# EAGLE design ESP32-C3 TFT Touch v1.1(3.5'' ili9488) (EAGLE 6.1)
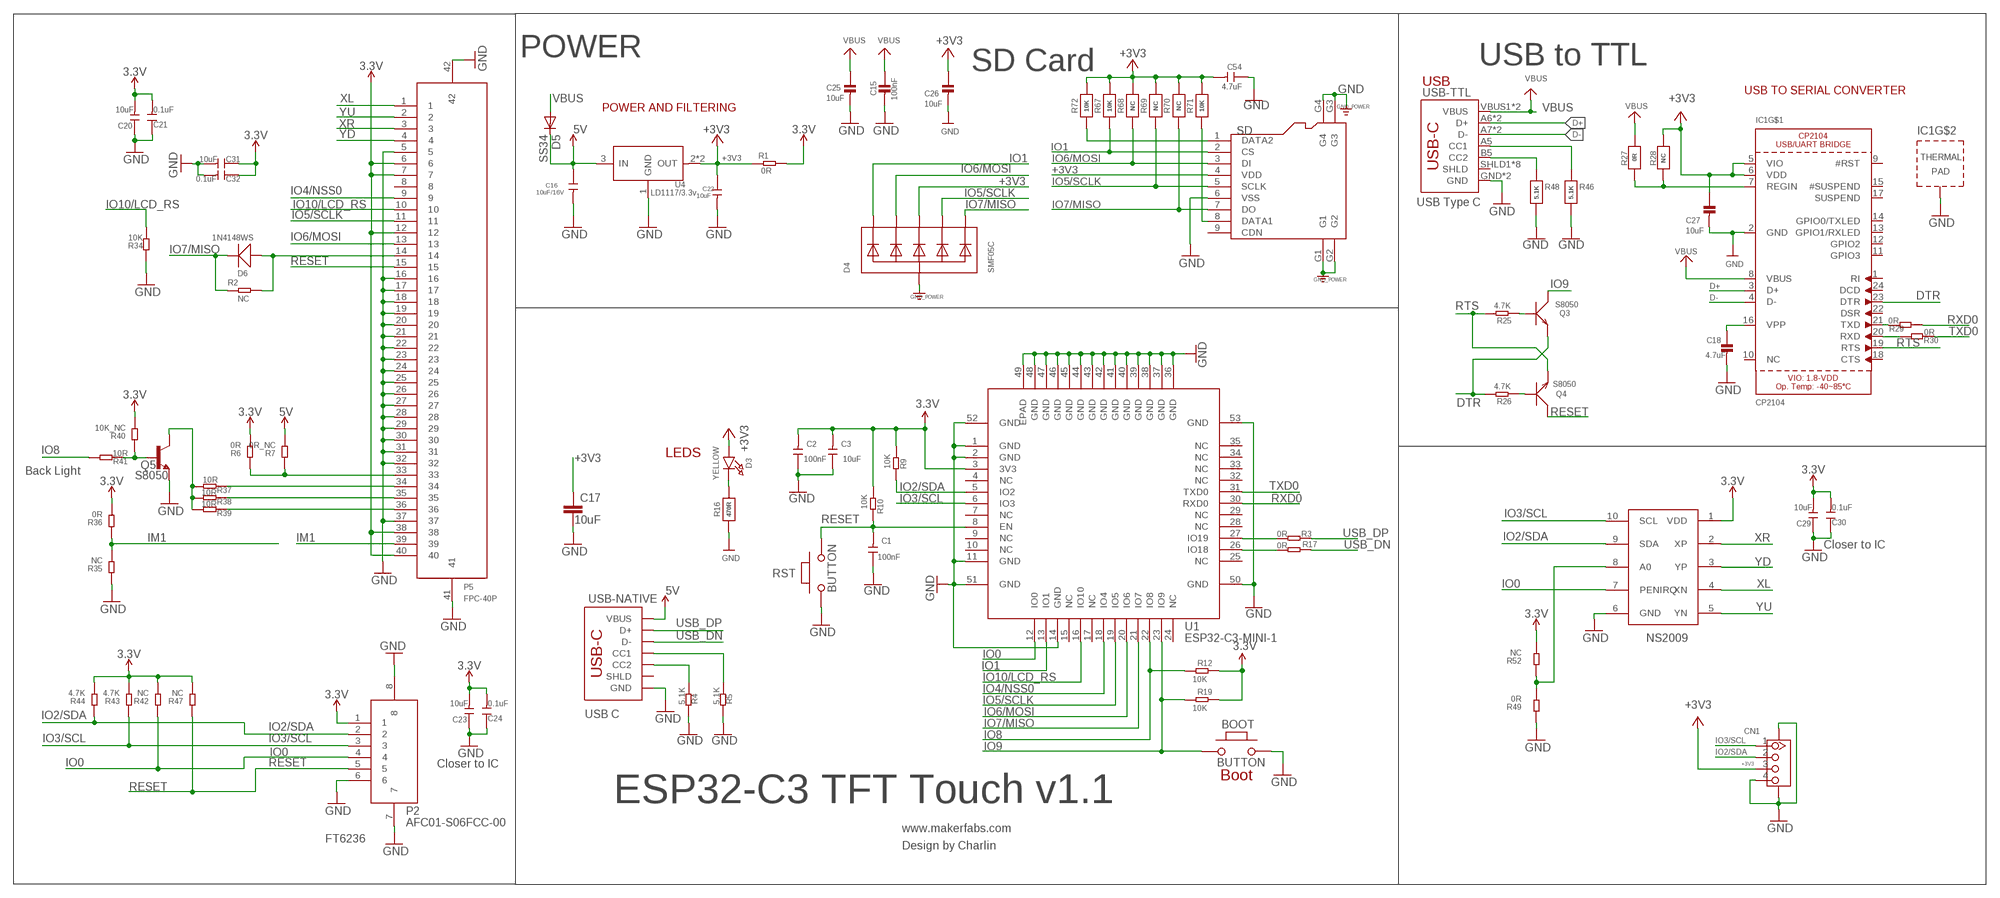
[diagram p0: schematic, sheet 1]

## Parts
BOOT  BUTTON  PB157  [157SW]
C1  100nF  C-0603  [C0603]
C2  100nF  C-0603  [C0603]
C3  10uF  C-0603  [C0603]
C15  100nF  CAP_CERAMIC0603_NO  [0603-NO]
C16  10uF/16V  C-0603  [C0603]
C17  10uF  C-EUC0603  [C0603]
C18  4.7uF  CAP_CERAMIC0603_NO  [0603-NO]
C20  10uF  DISCRETE_C-0603  [DISCRETE_C0603]
C21  0.1uF  DISCRETE_C-0603  [DISCRETE_C0603]
C22  10uF  C-0603  [C0603]
C23  10uF  DISCRETE_C-0603  [DISCRETE_C0603]
C24  0.1uF  DISCRETE_C-0603  [DISCRETE_C0603]
C25  10uF  CAP_CERAMIC0603_NO  [0603-NO]
C26  10uF  CAP_CERAMIC0603_NO  [0603-NO]
C27  10uF  CAP_CERAMIC0603_NO  [0603-NO]
C29  10uF  DISCRETE_C-0603  [DISCRETE_C0603]
C30  0.1uF  DISCRETE_C-0603  [DISCRETE_C0603]
C31  10uF  DISCRETE_C-0603  [DISCRETE_C0603]
C32  0.1uF  DISCRETE_C-0603  [DISCRETE_C0603]
C54  4.7uF  DISCRETE_C-0603  [DISCRETE_C0603]
CN1  GROVE-CONNECTOR-SMD'90D'  [HW4-SMD-2.0-90D]
D3  YELLOW  LED0805_NOOUTLINE  [CHIPLED_0805_NOOUTLINE]
D4  SMF05C  TVSARRAY_5LANE  [SOT363]
D5  SS34  DIODE-DO-214AC  [DO-214AC]
D6  1N4148WS  D'0805'  [SOD323]
IC1  CP2104  [QFN24_4MM_SMSC]
P2  AFC01-S06FCC-00  [SMD8-50P-740L535W]
P5  FPC-40P  [SMD42-50P-2560L490W]
Q3  S8050  TRANSISTOR-NPN-SOT23  [SOT23]
Q4  S8050  TRANSISTOR-NPN-SOT23  [SOT23]
Q5  S8050  SPARKFUN_TRANSISTOR_NPNSOT23  [SPARKFUN_SOT23]
R1  0R  R-0603  [R0603]
R2  NC  R-0603  [R0603]
R3  0R  R-0603  [R0603]
R4  5.1K  R-0603  [R0603]
R5  5.1K  R-0603  [R0603]
R6  0R  DISCRETE_R-0603  [DISCRETE_R0603]
R7  0R_NC  DISCRETE_R-0603  [DISCRETE_R0603]
R9  10K  R-0603  [R0603]
R10  10K  R-0603  [R0603]
R12  10K  R-0603  [R0603]
R16  470R  RESISTOR_0603_NOOUT  [0603-NO]
R17  0R  R-0603  [R0603]
R19  10K  R-0603  [R0603]
R25  4.7K  R-0603  [R0603]
R26  4.7K  R-0603  [R0603]
R27  0R  RESISTOR_0603_NOOUT  [0603-NO]
R28  NC  RESISTOR_0603_NOOUT  [0603-NO]
R29  0R  R-0603  [R0603]
R30  0R  R-0603  [R0603]
R34  10K  DISCRETE_R-0603  [DISCRETE_R0603]
R35  NC  DISCRETE_R-0603  [DISCRETE_R0603]
R36  0R  DISCRETE_R-0603  [DISCRETE_R0603]
R37  10R  DISCRETE_R-0603  [DISCRETE_R0603]
R38  10R  DISCRETE_R-0603  [DISCRETE_R0603]
R39  10R  DISCRETE_R-0603  [DISCRETE_R0603]
R40  10K_NC  DISCRETE_R-0603  [DISCRETE_R0603]
R41  10R  DISCRETE_R-0603  [DISCRETE_R0603]
R42  NC  DISCRETE_R-0603  [DISCRETE_R0603]
R43  4.7K  DISCRETE_R-0603  [DISCRETE_R0603]
R44  4.7K  DISCRETE_R-0603  [DISCRETE_R0603]
R46  5.1K  RESISTOR_0603_NOOUT  [0603-NO]
R47  NC  DISCRETE_R-0603  [DISCRETE_R0603]
R48  5.1K  RESISTOR_0603_NOOUT  [0603-NO]
R49  0R  DISCRETE_R-0603  [DISCRETE_R0603]
R52  NC  DISCRETE_R-0603  [DISCRETE_R0603]
R67  10K  RESISTOR_0603_NOOUT  [0603-NO]
R68  NC  RESISTOR_0603_NOOUT  [0603-NO]
R69  NC  RESISTOR_0603_NOOUT  [0603-NO]
R70  NC  RESISTOR_0603_NOOUT  [0603-NO]
R71  10K  RESISTOR_0603_NOOUT  [0603-NO]
R72  10K  RESISTOR_0603_NOOUT  [0603-NO]
RST  BUTTON  PB157  [157SW]
SD  HOLDER-MICROSD-9P  [9P-SMD-W/-RING]
U1  ESP32-C3-MINI-1  [ESP32-C3-MINI-1]
U4  LD1117/3.3v  LD1117'SOT89'  [SOT89]
U8  NS2009  [MSOP10]
USB-NATIVE  USB C  USB_C_4-LAYER-ISOLATED  [USB-C-16P-4LAYER-ISOLATED]
USB-TTL  USB_C5  [USB-C-16P-5]

## Nets
3.3V: C2.2 C3.2 C20.2 C21.2 C23.2 C24.2 C29.2 C30.2 C31.1 C32.1 P2.1 P5.6 P5.7 P5.12 P5.38 P5.40 R1.2 R6.2 R9.1 R10.1 R12.2 R19.2 R36.2 R40.2 R42.2 R43.2 R44.2 R47.2 R52.2 U1.3(3V3) U8.1(VDD)
5V: C16.1 D5.C R7.2 U4.3(IN) USB-NATIVE.VBUS1(VBUS) USB-NATIVE.VBUS2(VBUS)
+3V3: C17.1 C22.1 C26.1 C27.1 C54.2 CN1.3 D3.A D4.4(C3) IC1.5(VIO) IC1.6(VDD) R1.1 R28.1 R67.2 R68.2 R69.2 R70.2 R71.2 R72.2 SD.4(VDD) U4.2(OUT) U4.4(OUT)
D+: IC1.3(D+) USB-TTL.A6(D+) USB-TTL.B6(D+)
D-: IC1.4(D-) USB-TTL.A7(D-) USB-TTL.B7(D-)
DTR: IC1.23(DTR) Q3.2(E) R26.2
GND: BOOT.2 C1.1 C2.1 C3.1 C15.2 C16.2 C17.2 C18.2 C20.1 C21.1 C22.2 C23.1 C24.1 C25.2 C26.2 C27.2 C29.1 C30.1 C31.2 C32.2 C54.1 CN1.4 CN1.SS1 CN1.SS2 D4.2(A) IC1.2(GND) IC1.THERM(TP) P2.6 P2.7 P2.8 P5.5 P5.16 P5.17 P5.18 P5.19 P5.20 P5.21 P5.22 P5.23 P5.24 P5.25 P5.26 P5.27 P5.28 P5.29 P5.30 P5.31 P5.32 P5.37 P5.41 P5.42 Q5.2(E) R4.1 R5.1 R16.1 R34.1 R35.1 R46.2 R48.2 R49.1 RST.1 SD.6(VSS) SD.G1 SD.G2 SD.G3 SD.G4 U1.1(GND) U1.2(GND) U1.11(GND) U1.14(GND) U1.36(GND) U1.37(GND) U1.38(GND) U1.39(GND) U1.40(GND) U1.41(GND) U1.42(GND) U1.43(GND) U1.44(GND) U1.45(GND) U1.46(GND) U1.47(GND) U1.48(GND) U1.49(EPAD) U1.50(GND) U1.51(GND) U1.52(GND) U1.53(GND) U4.1(GND) U8.6(GND) USB-NATIVE.GND USB-NATIVE.GND2(GND) USB-TTL.GND USB-TTL.GND2(GND) ; supply symbol labelled GND_POWER
IM1: P5.39 R35.2 R36.1
IO0: P2.4 R42.1 U1.12(IO0) U8.7(PENIRQ)
IO1: D4.1(C1) R67.1 SD.2(CS) U1.13(IO1)
IO2/SDA: CN1.2 P2.2 R9.2 R44.1 U1.5(IO2) U8.9(SDA)
IO3/SCL: CN1.1 P2.3 R43.1 U1.6(IO3) U8.10(SCL)
IO4/NSS0: P5.9 U1.18(IO4)
IO5/SCLK: D4.5(C4) P5.11 R69.1 SD.5(SCLK) U1.19(IO5)
IO6/MOSI: D4.3(C2) P5.13 R68.1 SD.3(DI) U1.20(IO6)
IO7/MISO: D4.6(C5) D6.- R2.1 R70.1 SD.7(DO) U1.21(IO7)
IO8: R12.1 R41.2 U1.22(IO8)
IO9: BOOT.1 Q3.3(C) R19.1 U1.23(IO9)
IO10/LCD_RS: P5.10 R34.2 U1.16(IO10)
N$1: C18.1 IC1.16(VPP)
N$2: Q4.1(B) R26.1
N$3: Q3.1(B) R25.1
N$4: D6.+ P5.14 R2.2
N$7: D3.C R16.2
N$10: R46.1 USB-TTL.A5(CC1)
N$11: R48.1 USB-TTL.B5(CC2)
N$12: IC1.7(REGIN) R27.2 R28.2
N$13: R3.1 U1.27(IO19)
N$14: R5.2 USB-NATIVE.A5(CC1)
N$15: R4.2 USB-NATIVE.B5(CC2)
N$16: R17.1 U1.26(IO18)
N$18: IC1.21(TXD) R29.2
N$19: IC1.20(RXD) R30.2
N$20: P5.34 R37.1
N$21: P5.35 R38.1
N$22: P5.36 R39.1
N$23: Q5.1(B) R40.1 R41.1
N$24: Q5.3(C) R37.2 R38.2 R39.2
N$25: R49.2 R52.1 U8.8(A0)
N$26: P5.33 R6.1 R7.1
N$47: R72.1 SD.1(DATA2)
N$48: R71.1 SD.8(DATA1)
RESET: C1.2 P2.5 P5.15 Q4.3(C) R10.2 R47.1 RST.2 U1.8(EN)
RTS: IC1.19(RTS) Q4.2(E) R25.2
RXD0: R29.1 U1.30(RXD0)
TXD0: R30.1 U1.31(TXD0)
USB_DN: R17.2 USB-NATIVE.A7(D-) USB-NATIVE.B7(D-)
USB_DP: R3.2 USB-NATIVE.A6(D+) USB-NATIVE.B6(D+)
VBUS: C15.1 C25.1 D5.A IC1.8(VBUS) R27.1 USB-TTL.VBUS1(VBUS) USB-TTL.VBUS2(VBUS)
XL: P5.1 U8.4(XN)
XR: P5.3 U8.2(XP)
YD: P5.4 U8.3(YP)
YU: P5.2 U8.5(YN)
Unconnected: IC1.1(RI) IC1.9(#RST) IC1.10(NC) IC1.11(GPIO3) IC1.12(GPIO2) IC1.13(GPIO1/RXLED) IC1.14(GPIO0/TXLED) IC1.15(#SUSPEND) IC1.17(SUSPEND) IC1.18(CTS) IC1.22(DSR) IC1.24(DCD) P5.8 SD.9(CDN) U1.4(NC) U1.7(NC) U1.9(NC) U1.10(NC) U1.15(NC) U1.17(NC) U1.24(NC) U1.25(NC) U1.28(NC) U1.29(NC) U1.32(NC) U1.33(NC) U1.34(NC) U1.35(NC) USB-NATIVE.SHLD1(SHLD) USB-NATIVE.SHLD2(SHLD) USB-NATIVE.SHLD3(SHLD) USB-NATIVE.SHLD4(SHLD) USB-NATIVE.SHLD5(SHLD) USB-NATIVE.SHLD6(SHLD) USB-NATIVE.SHLD7(SHLD) USB-NATIVE.SHLD8(SHLD) USB-TTL.SHLD1(SHLD) USB-TTL.SHLD2(SHLD) USB-TTL.SHLD3(SHLD) USB-TTL.SHLD4(SHLD) USB-TTL.SHLD5(SHLD) USB-TTL.SHLD6(SHLD) USB-TTL.SHLD7(SHLD) USB-TTL.SHLD8(SHLD)

## Notes on the sheet
- POWER | USB to TTL
- SD Card
- USB
- USB TO SERIAL CONVERTER
- POWER AND FILTERING
- USB Type C
- LEDS
- Back Light
- Closer to IC
- NS2009
- Closer to IC
- Boot
- ESP32-C3 TFT Touch v1.1
- www.makerfabs.com
- FT6236
- Design by Charlin

## Library data of the parts
BOOT RST = MySMD:PB157
C1-C3 C16 C22 = Discrete:C*: Ceramic Capacitors
C15 C18 C25-C27 = microbuilder:CAP_CERAMIC: Ceramic Capacitors For new designs, use the packages preceded by an '_' character since they are more reliable: The following footprints should be used on most boards: _0402 - Standard footprint for regular board layouts _0603 - Standard footprint for regular board layouts _0805 - Standard footprint for regular board layouts _1206 - Standard footprint for regular board layouts For extremely tight-pitch boards where space is at a premium, the following 'micro-pitch' footprints can be used (smaller pads, no silkscreen outline, etc.): _0402MP - Micro-pitch footprint for very dense/compact boards _0603MP - Micro-pitch footprint for very dense/compact boards _0805MP - Micro-pitch footprint for very dense/compact boards _1206MP - Micro-pitch footprint for very dense/compact boards
C17 = rcl:C-EU: CAPACITOR, European symbol
C20 C21 C23 C24 C29-C32 C54 = A9G:DISCRETE_C*: Ceramic Capacitors
CN1 = Connector-new:GROVE-CONNECTOR-SMD: 4P-SMD-2.0:320110030;4P-SMD-2.0-90D:320110032
D3 = microbuilder:LED: LED 0603 - 0603 Surface Mount Package 2mA: Green LED - Low Power (3.9mcd, 2ma, 1.7Vf) - Digikey: 475-2709-2-ND Orange LED - Low Power (9.8mcd, 2ma, 1.8Vf) - Digikey: 475-1194-2-ND Red LED - Low Power (5mcd, 2ma, 1.8Vf) - Digikey: 475-1195-2-ND Yellow LED - Low Power (7mcd, 2ma, 1.8Vf) - Digikey: 475-1196-2-ND 5mA: Blue LED - Low Power (17mcd, 5ma, 2.9Vf) - Digikey: LNJ937W8CRACT-ND 0805 - 0805 Surface Mount Package 2mA: Red LED (8.8mcd, 2mA, 1.8Vf, Clear) - Low Power [Digikey: 475-2510-1-ND] Green LED (5mcd, 2mA, 1.8Vf, Clear) - Low Power [Digikey: 475-2730-1-ND] Yellow LED (11.3mcd, 2mA, 1.8Vf, Clear) - Low Power [Digikey: 475-2555-1-ND] 20mA: Red LED (104mcd, 20mA, Diffused) - LS R976 [Digikey: 475-1278-6-ND] Red LED (12mcd, 20mA, 2.0Vf, Clear) - APT2012EC [Digikey: 754-1128-1-ND] Green LED (15mcd, 20mA, 2.2Vf, Clear) - APT2012GC [Digikey: 754-1131-1-ND] Orange LED (160mcd, 20mA, 2.1Vf, Clear) - APT2012SECK [Digikey: 754-1130-1-ND] 1206 - 1206 Surface Mount Package Green LED (26mcd, 20mA, Diffused) - LG N971 [Digikey: 475-1407-6-ND] Red LED (15mcd, 20mA, Diffused) - LH N974 [Digikey: 475-1416-6-ND] Cree - Cree High-Power Surface Mount LEDs XPEBWT-L1-0000-00D50 - White 111lm 350mA 2.9Vf 6200K 110° XTEAWT-00-0000-00000LEE3 - White 114lm 350mA 2.85Vf 5000K 115° Everlight - Everlight 45-21 Series Surface Mount LEDs 45-21/QK2C-B2832AC2CB2/2T - Warm White 2000mcd 20mA 3.25Vf 3050K 120° 45-21/LK2C-B38452C4CB2/2T - Nuetral White 2000mcd 20mA 3.25Vf 4150K 120° 45-21/LK2C-B50634C6CB2/2T - Cold White 2200mcd 20mA 3.25Vf 5650K 120° PLCC2 Reverse Mount LS T77K-J1L2-1-0-2-R18-Z - Red 11.25mcd 2mA 1.8Vf 630nm 120° LO T77K-L1M2-24-Z - Orange 19.6mcd 2mA 1.8Vf 606nm 120° LY T77K-K2M1-26-Z - Yellow 15.7mcd 2mA 1.8Vf 587nm 120°
D4 = microbuilder:TVSARRAY_5LANE: Voltage Transient Suppressor Array SOT363 SMF05C - 100W 5V: Digikey - SMF05CT1GOSCT-ND
D5 = diode:DIODE-: DIODE
D6 = Discrete:D*
IC1 = microbuilder:CP2104: CP2104 - USB to UART Bridge VDD Output: 3.45V
P2 = self:AFC01-S06FCC-00
P5 = self:FPC-40P
Q3 Q4 = Discrete:TRANSISTOR-NPN*: NPN audion
Q5 = Adafruit_HUZZAH32_ESP32_Feather:SPARKFUN_TRANSISTOR_NPN: Transistor NPN BJT configuration in SOT23 package. MMBT2222 is the common NPN we use. Double check BCE configuration again layout.
R1-R5 R9 R10 R12 R17 R19 R25 R26 R29 R30 = Discrete:R*
R6 R7 R34-R44 R47 R49 R52 = A9G:DISCRETE_R*
R16 R27 R28 R46 R48 R67-R72 = microbuilder:RESISTOR: Resistors For new designs, use the packages preceded by an '_' character since they are more reliable: The following footprints should be used on most boards: _0402 - Standard footprint for regular board layouts _0603 - Standard footprint for regular board layouts _0805 - Standard footprint for regular board layouts _1206 - Standard footprint for regular board layouts For extremely tight-pitch boards where space is at a premium, the following 'micro-pitch' footprints can be used (smaller pads, no silkscreen outline, etc.): _0402MP - Micro-pitch footprint for very dense/compact boards _0603MP - Micro-pitch footprint for very dense/compact boards _0805MP - Micro-pitch footprint for very dense/compact boards _1206MP - Micro-pitch footprint for very dense/compact boards
SD = Connector:HOLDER-MICROSD-9P
U1 = self:ESP32-C3-MINI-1
U4 = IC:LD1117: Low Drop Fixed And Adjustable Positive Voltage Regulators http://www.datasheetcatalog.org/datasheet/SGSThomsonMicroelectronics/mXuqtqv.pdf
U8 = NS2009:NS2009
USB-NATIVE = SparkFun-Connectors:USB_C: USB Type C 16Pin Connector Super Speed pins not available on the 16-pin purely SMD connector so this part is best for USB 2.0 implementations. D1 and D2 are tied together enabling D+/- no matter which way the cable is plugged into the connector. The two channel configuration pins (CC1/2) are ...; PROD_ID: CONN-14122; VALUE: USB Female Type C Connector
USB-TTL = USBC:USB_C: USB Type C 16Pin Connector Super Speed pins not available on the 16-pin purely SMD connector so this part is best for USB 2.0 implementations. D1 and D2 are tied together enabling D+/- no matter which way the cable is plugged into the connector. The two channel configuration pins (CC1/2) are ...

## Net classes
1 vbat: width 0.254 mm, drill 0.305 mm, clearance 0.152 mm

## Board
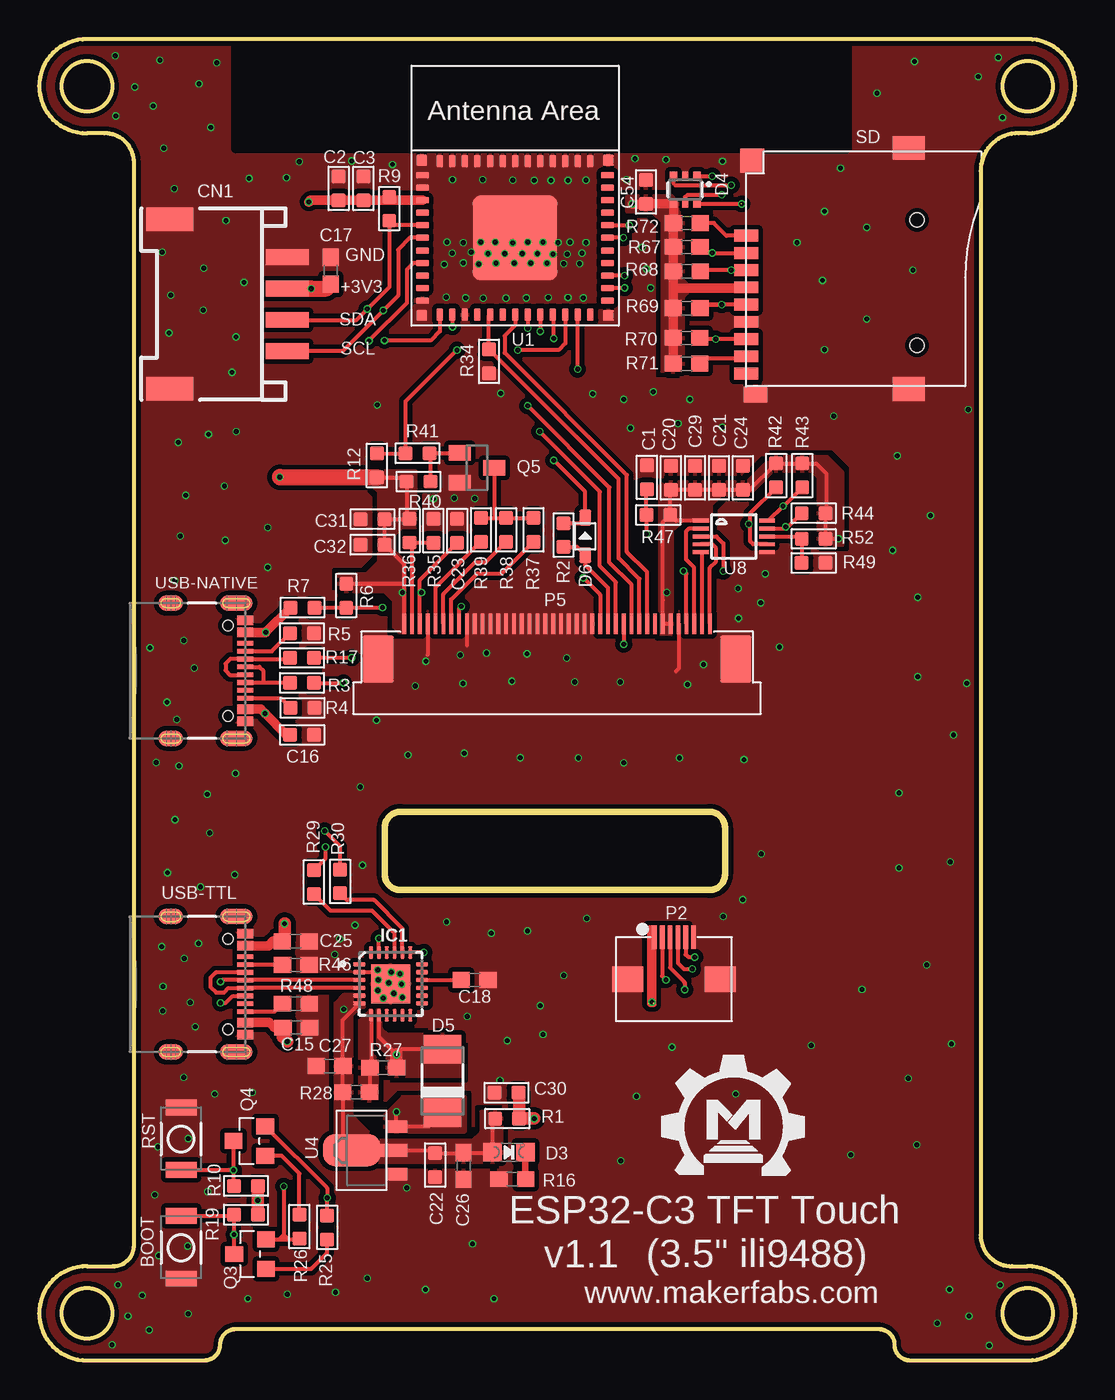
[diagram p1: board, top side]
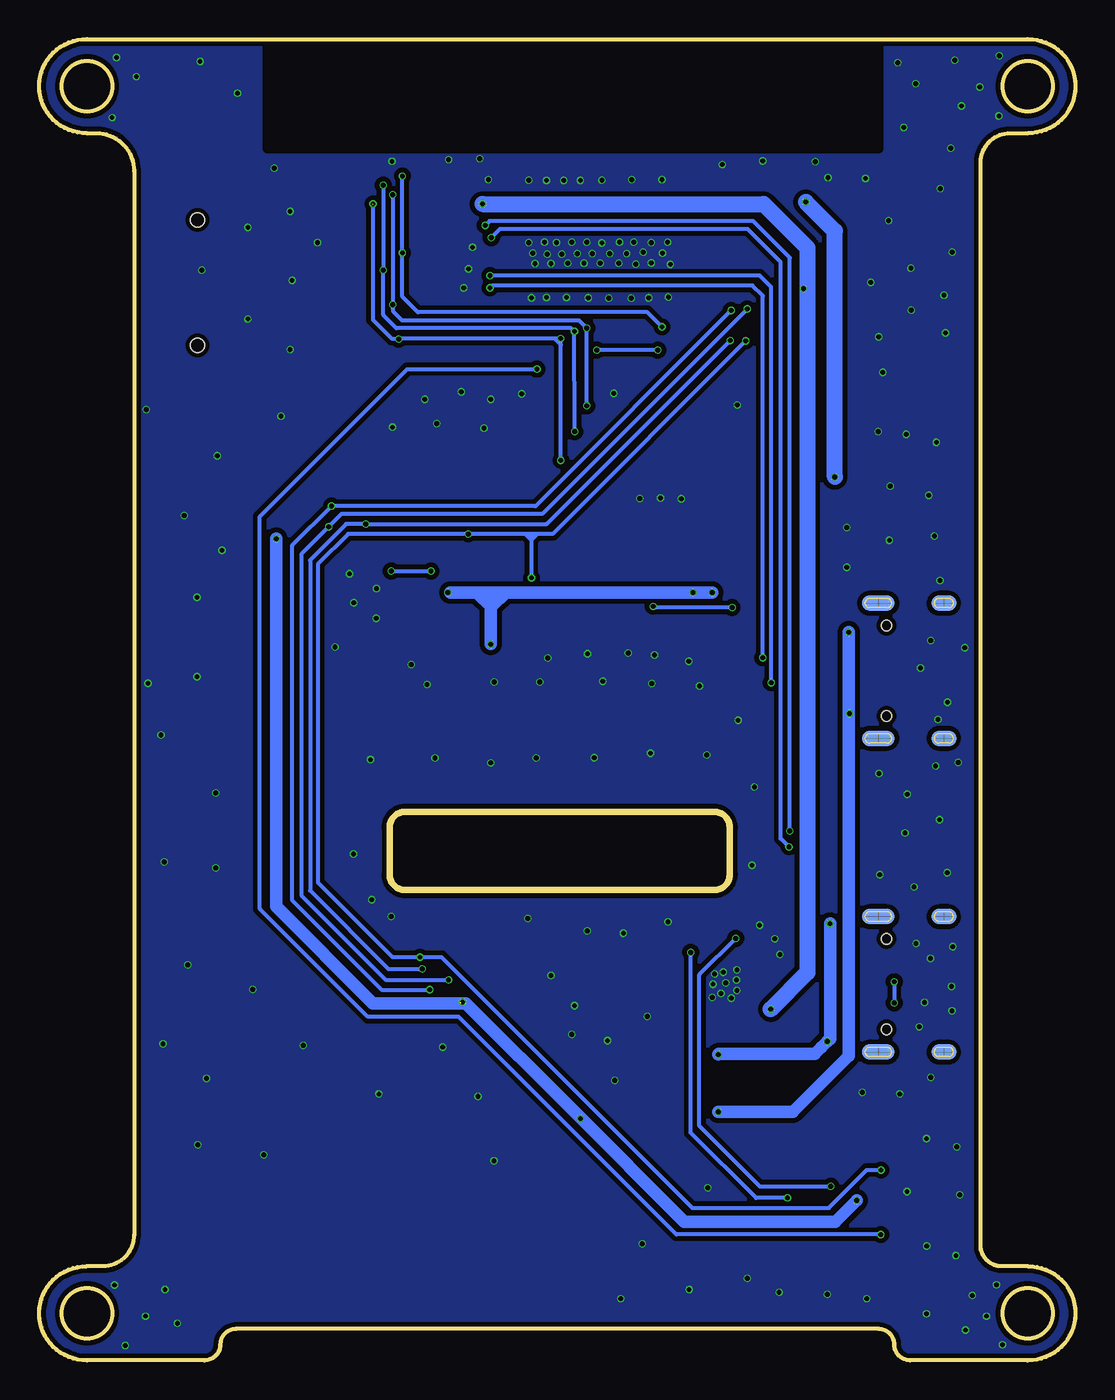
[diagram p2: board, bottom side, seen from below]

Size 66.1 x 84.3 mm. Coordinates in mm from the lower left corner, seen from the top.
Outline: 55.55,0 63.05,0 arc182 63.05,6 62.05,6 arc-90 60.05,8 60.05,75.9 arc-90 62.45,78.3 63.05,78.3 arc182 63.05,84.3 3.05,84.3 arc182 3.05,78.3 4.17,78.3 arc-90 6.05,76.42 6.05,7.34 arc-90 4.7,6 3.05,6 arc182 3.05,0 10.55,0 arc90 11.55,1 arc-90 12.55,2 53.55,2 arc-90 54.55,1 arc90 55.55,0
Outline: 23.05,35 42.75,35 arc-90 43.75,34 43.75,31 arc-90 42.75,30 23.05,30 arc-90 22.05,31 22.05,34 arc-90 23.05,35
Outline: circle at 3.05,81.3 radius 1.6
Outline: circle at 3.05,3 radius 1.6
Outline: circle at 63.05,3 radius 1.6
Outline: circle at 63.05,81.3 radius 1.6
Copper layers (1*16): Top 0.035mm / dielectric 1.5mm / Bottom 0.035mm
Design rules: minimum track width 6mil, minimum drill 10mil, track to track 6mil, track to pad 6mil, pad to pad 6mil, via to via 6mil, smd to smd 0mil, copper to edge 10mil, drill to drill 10mil, minimum pad ring 3mil, minimum via ring 3mil, stop-mask expansion 2mil, vias tented up to drill 100mil, thermal gap 0mil
tRestrict: area 12.5,77.3 to 51.5,85
bRestrict: area 12.5,77.3 to 51.5,85

### Footprints (pad centres in the part's own frame; a part is rotated, then mirrored left to right if it is on the bottom)
157SW = smd 1.016 x 1.981: 1 0,0; 2 4,0
C0603 = smd 0.889 x 0.889: 1 -0.762,0; 2 0.762,0
0603-NO = smd 1.1 x 1: 1 -0.85,0; 2 0.85,0
C0603' = smd 1.1 x 1: 1 -0.85,0; 2 0.85,0
DISCRETE_C0603 = smd 0.889 x 0.889: 1 -0.762,0; 2 0.762,0
HW4-SMD-2.0-90D = smd 1.01 x 2.74: 1 -3,-0.1; 2 -1,-0.1; 3 1,-0.1; 4 3,-0.1 | smd 1.5 x 3: SS1 -5.4,7.4; SS2 5.4,7.4
CHIPLED_0805_NOOUTLINE = smd 1.2 x 1.2: A 0,-1.05; C 0,1.05
SOT363 = smd 0.5 x 0.5: 1 -0.75,-0.9; 3 0.75,-0.9; 4 0.75,0.9; 6 -0.75,0.9 | smd 0.4 x 0.5: 2 0,-0.9; 5 0,0.9
DO-214AC = smd 1.8 x 2.4: A 2.025,0; C -2.025,0
SOD323 = smd 1 x 0.8: + -1.2,0; - 1.2,0
QFN24_4MM_SMSC = smd 0.8 x 0.28: 1 -2,1.25; 2 -2,0.75; 3 -2,0.25; 4 -2,-0.25; 5 -2,-0.75; 6 -2,-1.25; 13 2,-1.25; 14 2,-0.75; 15 2,-0.25; 16 2,0.25; 17 2,0.75; 18 2,1.25 | smd 0.28 x 0.8: 7 -1.25,-2; 8 -0.75,-2; 9 -0.25,-2; 10 0.25,-2; 11 0.75,-2; 12 1.25,-2; 19 1.25,2; 20 0.75,2; 21 0.25,2; 22 -0.25,2; 23 -0.75,2; 24 -1.25,2 | smd 2.5 x 2.5: THERM 0,0
SMD8-50P-740L535W = smd 0.3 x 1.5: 1 -1.25,0; 2 -0.75,0; 3 -0.25,0; 4 0.25,0; 5 0.75,0; 6 1.25,0 | smd 2 x 1.6: 7 2.95,-2.68; 8 -2.95,-2.68
SMD42-50P-2560L490W = smd 0.3 x 1.3: 1 9.75,0; 2 9.25,0; 3 8.75,0; 4 8.25,0; 5 7.75,0; 6 7.25,0; 7 6.75,0; 8 6.25,0; 9 5.75,0; 10 5.25,0; 11 4.75,0; 12 4.25,0; 13 3.75,0; 14 3.25,0; 15 2.75,0; 16 2.25,0; 17 1.75,0; 18 1.25,0; 19 0.75,0; 20 0.25,0; 21 -0.25,0; 22 -0.75,0; 23 -1.25,0; 24 -1.75,0; 25 -2.25,0; 26 -2.75,0; 27 -3.25,0; 28 -3.75,0; 29 -4.25,0; 30 -4.75,0; 31 -5.25,0; 32 -5.75,0; 33 -6.25,0; 34 -6.75,0; 35 -7.25,0; 36 -7.75,0; 37 -8.25,0; 38 -8.75,0; 39 -9.25,0; 40 -9.75,0 | smd 2 x 3: 41 -11.4,-2.25; 42 11.4,-2.25
SOT23 = smd 1.016 x 1.143: 1 -0.95,-1.016; 2 0.95,-1.016; 3 0,1.016
SPARKFUN_SOT23 = smd 1 x 1.4: 1 -0.95,-1.1; 2 0.95,-1.1; 3 0,1.1
R0603 = smd 0.889 x 0.889: 1 -0.762,0; 2 0.762,0
DISCRETE_R0603 = smd 0.889 x 0.889: 1 -0.762,0; 2 0.762,0
9P-SMD-W/-RING = smd 1.524 x 0.762: 1 0,4.4; 2 0,3.3; 3 0,2.2; 4 0,1.1; 5 0,0; 6 0,-1.1; 7 0,-2.2; 8 0,-3.3; 9 0,-4.4 | smd 1.524 x 1.016: G1 0.6,-5.746 | smd 2.032 x 1.524: G2 10.373,-5.4; G3 10.373,10 | smd 1.524 x 1.524: G4 0.392,9.181 | hole 0.889: 10.9,-2.6; 10.9,5.4
ESP32-C3-MINI-1 = smd 0.8 x 0.4: 1 -5.9,1.3; 2 -5.9,0.5; 3 -5.9,-0.3; 4 -5.9,-1.1; 5 -5.9,-1.9; 6 -5.9,-2.7; 7 -5.9,-3.5; 8 -5.9,-4.3; 9 -5.9,-5.1; 10 -5.9,-5.9; 11 -5.9,-6.7; 25 5.9,-6.7; 26 5.9,-5.9; 27 5.9,-5.1; 28 5.9,-4.3; 29 5.9,-3.5; 30 5.9,-2.7; 31 5.9,-1.9; 32 5.9,-1.1; 33 5.9,-0.3; 34 5.9,0.5; 35 5.9,1.3 | smd 0.4 x 0.8: 12 -4.8,-7.6; 13 -4,-7.6; 14 -3.2,-7.6; 15 -2.4,-7.6; 16 -1.6,-7.6; 17 -0.8,-7.6; 18 0,-7.6; 19 0.8,-7.6; 20 1.6,-7.6; 21 2.4,-7.6; 22 3.2,-7.6; 23 4,-7.6; 24 4.8,-7.6; 36 4.8,2.2; 37 4,2.2; 38 3.2,2.2; 39 2.4,2.2; 40 1.6,2.2; 41 0.8,2.2; 42 0,2.2; 43 -0.8,2.2; 44 -1.6,2.2; 45 -2.4,2.2; 46 -3.2,2.2; 47 -4,2.2; 48 -4.8,2.2 | smd 5.4 x 5.4: 49 0,-2.7 | smd 0.7 x 0.7: 50 -5.95,2.25; 51 -5.95,-7.65; 52 5.95,2.25; 53 5.95,-7.65
SOT89 = smd 0.8 x 1.4: 1 -1.524,-1.905; 3 1.524,-1.905 | smd 0.8 x 1.9: 2 0,-1.651 | smd 2.032 x 3.65: 4 0,0.94
MSOP10 = smd 0.25 x 1: 1 -1,-2.113; 2 -0.5,-2.113; 3 0,-2.113; 4 0.5,-2.113; 5 1,-2.113; 6 1,2.113; 7 0.5,2.113; 8 0,2.113; 9 -0.5,2.113; 10 -1,2.113
USB-C-16P-4LAYER-ISOLATED = smd 0.3 x 1: A5 -1.25,-0.34; A6 -0.25,-0.34; A7 0.25,-0.34; A8 1.25,-0.34; B5 1.75,-0.34; B6 0.75,-0.34; B7 -0.75,-0.34; B8 -1.75,-0.34 | smd 0.6 x 1: GND -3.225,-0.34; GND2 3.225,-0.34; VBUS1 -2.45,-0.34; VBUS2 2.45,-0.34 | smd 1 x 2.1: SHLD1 -4.32,-0.915; SHLD2 4.32,-0.915 | smd 1 x 2.1 bottom: SHLD3 -4.32,-0.915; SHLD4 4.32,-0.915 | smd 1 x 1.6: SHLD5 -4.32,-5.095; SHLD8 4.32,-5.095 | smd 1 x 1.6 bottom: SHLD6 -4.32,-5.095; SHLD7 4.32,-5.095 | hole 0.65: -2.89,-1.445; 2.89,-1.445
USB-C-16P-5 = smd 0.3 x 1: A5 -1.25,-0.34; A6 -0.25,-0.34; A7 0.25,-0.34; A8 1.25,-0.34; B5 1.75,-0.34; B6 0.75,-0.34; B7 -0.75,-0.34; B8 -1.75,-0.34 | smd 0.6 x 1: GND -3.225,-0.34; GND2 3.225,-0.34; VBUS1 -2.45,-0.34; VBUS2 2.45,-0.34 | smd 1 x 2.1: SHLD1 -4.32,-0.915; SHLD2 4.32,-0.915 | smd 1 x 2.1 bottom: SHLD3 -4.32,-0.915; SHLD4 4.32,-0.915 | smd 1 x 1.6: SHLD5 -4.32,-5.095; SHLD8 4.32,-5.095 | smd 1 x 1.6 bottom: SHLD6 -4.32,-5.095; SHLD7 4.32,-5.095 | hole 0.65: -2.89,-1.445; 2.89,-1.445

### Placement (x,y rotation side)
BOOT  9.05,9.22 270 top
C1  38.76,56.34 270 top
C2  19.1,74.78 270 top
C3  20.68,74.78 270 top
C15  16.4,21.24 0 top
C16  16.77,39.91 0 top
C17  10uF  [C0603']  18.6,69.53 90 top
C18  27.77,24.27 0 top
C20  40.29,56.31 270 top
C21  43.36,56.31 270 top
C22  25.26,12.46 270 top
C23  26.66,52.94 270 top
C24  44.88,56.31 270 top
C25  16.36,26.73 0 top
C26  27.07,12.4 270 top
C27  18.53,18.79 180 top
C29  41.83,56.31 270 top
C30  29.81,17.07 0 top
C31  21.26,53.68 180 top
C32  21.26,52.04 180 top
C54  38.71,74.55 270 top
CN1  15.73,67.39 90 top
D3  29.96,13.28 270 top
D4  41.21,74.7 180 top
D5  25.73,17.83 90 top
D6  34.83,52.57 90 top
IC1  22.42,24.02 0 top
P2  40.49,27 0 top
P5  33.03,47 0 top
Q3  13.45,6.78 90 top
Q4  13.41,13.99 90 top
Q5  27.93,56.95 270 top
R1  29.85,15.42 0 top
R2  33.44,52.66 270 top
R3  16.77,43.23 180 top
R4  16.79,41.63 180 top
R5  16.77,46.41 180 top
R6  19.59,48.79 90 top
R7  16.79,48.03 180 top
R9  22.33,73.48 270 top
R10  13.19,11.13 180 top
R12  21.54,57.1 270 top
R16  30.18,11.56 0 top
R17  16.77,44.83 180 top
R19  13.19,9.3 0 top
R25  18.37,8.48 90 top
R26  16.6,8.53 270 top
R27  21.94,18.68 180 top
R28  20.22,17.11 0 top
R29  17.51,30.52 270 top
R30  19.19,30.56 270 top
R34  28.69,63.75 90 top
R35  25.14,52.94 270 top
R36  23.62,52.94 90 top
R37  31.53,52.99 90 top
R38  29.79,52.99 90 top
R39  28.18,52.99 90 top
R40  24.2,56.07 180 top
R41  24.13,57.89 180 top
R42  47.01,56.46 90 top
R43  48.67,56.46 90 top
R44  49.4,54.05 0 top
R46  16.36,25.23 0 top
R47  39.49,53.94 0 top
R48  16.37,22.76 0 top
R49  49.4,50.88 180 top
R52  49.4,52.42 0 top
R67  41.31,71.04 180 top
R68  41.31,69.49 180 top
R69  41.3,67.14 180 top
R70  41.29,65.23 180 top
R71  41.29,63.59 180 top
R72  41.31,72.56 180 top
RST  9.05,16.15 270 top
SD  45.09,67.36 0 top
U1  30.36,74.32 0 top
U4  20.87,13.4 90 top
U8  44.31,52.57 270 top
U$1  [MAKERFABS_0.3]  40.17,11.84 0 top
USB-NATIVE  13.49,44 270 top
USB-TTL  13.49,24 270 top

### Tracks (layer width: path | path; a pad name or v marks a point on that pad's centre or on a via)
3.3V  (via drill 0.3)  (2 unrouted)
  Top 0.254: 23.28,49.48 P5.40 23.28,48.88 v23.17,49 | 23.28,49.48 23.28,50.78 C32.1 C31.1 23.6,53.68 R36.2 23.44,53.89 R40.2 23.17,56.34 R12.2 | P5.7 P5.6 | 24.28,48.94 24.28,49.8 C23.2 | P5.7 39.78,53.47 R47.2 | R47.2 40.25,55.52 C20.2 C29.2 C21.2 C24.2 45.34,55.55 R42.2 R43.2 49.56,57.22 50.19,56.59 50.19,54.08 R44.2 R52.2 v50.98,52.42 v50.98,52.43 | U8.1 40.63,53.57 R47.2 | P2.1 39.24,22.85 | 39.25,27.61 38.89,27.61 38.89,22.73 38.94,22.68 39.25,22.68 39.25,27.61 | 39.25,27.61 39.09,27.46 39.09,22.68 | R9.1 22.33,74.07 22.38,74.02 | 20.76,74.02 20.75,74.02 C3.2 C2.2 | R6.2 23.21,49.55 23.28,49.48 | P5.7 39.78,48.49 | P5.12 37.28,45.7 v37.29,45.7 | P5.38 24.28,48.89 | 24.28,48.89 v24.39,49 | 24.28,48.89 24.28,48.94 | 24.28,48.94 24.34,49
  Top 0.61: U1.3 22.38,74.02 20.76,74.02 17.31,74.02 v17.2,73.91
  Top 0.813: v31.58,15.43 R1.2 30.62,17.07 C30.2 | R19.2 v13.95,10.21 R10.1
  Top 1.016: R12.2 15.37,56.34 v15.34,56.36
  Bottom 0.254: v31.58,15.43 31.58,15.47 32.05,15.94 | 38.89,22.78 39.17,22.78 v39.09,22.86 | 39.88,49 v40.03,49
  Bottom 0.813: v13.95,10.21 15.32,8.84 24.95,8.84 32.05,15.94 38.89,22.78 44.81,22.78 50.98,28.96 v50.98,52.43 | 39.88,49 38.15,49 | 38.15,49 37.04,49 | 37.04,49 36.35,49 | v37.29,45.7 37.29,48.74 37.04,49 | 36.35,49 37.27,48.08 38.15,48.97 38.15,49 | v23.17,49 v24.39,49 36.35,49
  Bottom 1.016: v15.34,56.36 15.34,72.06 v17.2,73.91
  pour Top: 19.08,49.07 22.02,49.07 22.61,48.49 22.61,46.81 22.94,46.48 23.32,46.48 23.32,50.95 22.69,51.59 22.69,52.73 23.12,53.16 24.01,53.16 24.01,56.67 24.01,56.72 20.78,56.72 20.78,55.96 21.14,55.96 21.64,55.45 21.64,50.93 20.86,50.14 19.08,50.14
  pour Top: 39.63,46.33 39.63,55.78 39.88,56.03 45.16,56.03 46.79,57.66 50.24,57.66 51.21,56.69 51.21,52.02 49.74,52.02 49.74,56.31 49.3,56.74 46.76,56.74 45.21,55.19 43.46,55.19 42.83,54.56 42.83,53.54 40.97,53.54 40.57,53.14 40.36,52.93 40.36,46.35 40.34,46.33
5V  (via drill 0.3)
  Top 0.254: D5.C 24.85,14.92 U4.3 22.78,15.84 v22.79,15.85
  Top 0.61: USB-NATIVE.VBUS1 v14.45,46.45 v14.46,46.46 R7.2 | USB-NATIVE.VBUS2 14.13,41.55 v14.41,41.27 15.77,39.91 C16.1
  Bottom 0.254: v14.41,41.27 14.41,41.05 14.46,41
  Bottom 0.813: v22.79,15.85 18.04,15.85 14.46,19.43 14.46,41 v14.46,46.46
  pour Top: 27.13,14.58 22.08,14.58 22.08,15.67 23.22,16.81 27.08,16.81 27.13,16.81
+3V3  (via drill 0.3)
  Top 0.254: IC1.5 IC1.6 19.38,21.73 C27.1 19.37,18.77 R28.1 19.37,13.96 U4.4 U4.2 25.08,13.4 C22.1 27.03,13.22 C26.1 28.89,13.25 D3.A 28.92,15.25 R1.1
  Top 0.61: v37.82,73.79 C54.2 D4.4 R72.2 R67.2 R68.2 40.45,69.48 40.45,68.33 | 40.45,68.33 R69.2 40.44,67.13 R70.2 R71.2 | SD.4 44.61,68.46 44.55,68.4 40.53,68.4 40.45,68.33
  Top 1.016: CN1.3 v17.35,68.39 18.31,68.39 C17.1
  Bottom 0.254: v17.35,68.39 17.35,68.33 17.1,68.07
  Bottom 1.016: v19.43,22.4 17.1,24.74 17.1,68.07 17.1,70.99 19.89,73.79 v37.82,73.79
  pour Top: 20.73,23.32 19.43,23.32 18.88,22.76 18.88,13.34 19.26,12.95 19.54,12.67 29.49,12.67 29.49,15.85 28.2,15.85 28.2,14.53 27.66,14 21.54,14 20.07,15.47 19.94,15.6 19.94,21.34 19.94,22.05 20.45,22.56 20.7,22.56 20.73,22.56
  pour Top: 37.54,74.3 40.34,74.3 40.69,73.94 40.69,73.36 41.05,73 41.05,68.91 41.33,68.63 41.33,68.12 41.05,67.84 41.05,63.07 39.78,63.07 39.78,72.64 39.25,73.18 39.14,73.28 37.52,73.28 37.52,74.27
D+  (via drill 0.3)
  Top 0.254: IC1.3 13.17,24.27 | 13.17,24.27 USB-TTL.A6 | 13.17,24.27 11.67,24.27 v11.56,24.16 | v11.56,22.81 11.92,22.81 12.35,23.24 USB-TTL.B6
  Bottom 0.254: v11.56,24.16 v11.56,22.81
D-
  Top 0.254: IC1.4 13.17,23.77 USB-TTL.A7 12.07,23.75 11.79,23.47 11.28,23.47 10.93,23.82 10.93,24.41 11.27,24.75 USB-TTL.B7
DTR  (via drill 0.3)
  Top 0.254: 15.6,7.73 Q3.2 14.62,7.73 | 15.6,7.73 16.56,7.73 R26.2 | v15.6,11.1 15.6,8 | 15.6,8 15.6,7.73 | IC1.23 v21.67,26.92 | 15.34,7.75 15.6,8 | 15.6,8 15.85,7.75
  Bottom 0.254: v21.67,26.92 23.98,24.61 23.98,14.96 20.12,11.1 v15.6,11.1
GND  (via drill 0.3)
  Top 0.254: IC1.THERM 22.42,24.73 v22.46,24.77 | P5.37 24.78,45.02 24.77,45.01 | P5.32 27.28,45.62 | P5.5 40.78,44.13 40.62,43.97 | IC1.2 21.45,24.77 v21.59,24.92
  other vias: 8.92,37.92 8.77,40.89 8.16,41.99 9.22,45.92 6.1,81.25 8.64,49.76 7.47,38.15 7.57,13.61 7.01,1.93 6.58,4.14 7.62,6.68 9.5,2.97 29.01,3.94 57.28,2.36 58.07,4.52 58.19,20.19 59.16,43.21 59.26,60.66 59.9,81.92 61.17,83.13 55.83,82.88 53.44,80.85 61.45,79.3 7.27,80.04 10.95,78.66 10.19,81.46 4.88,79.4 7.06,45.47 7.95,77.34 7.7,82.96 11.33,82.8 58.12,31.8 56.62,25.22 55.43,17.98 19.18,26.9 18.85,25.91 20.15,27.76 21.62,24.28 23.02,24.66 23.12,24 22.3,24.08 21.59,23.6 21.95,23.11 22.61,23.42 23.17,23.16 25.99,27.97 31.14,27.41 28.83,27.25 33.45,24.56 31.96,22.63 34.93,28.19 29.85,20.4 27.31,21.95 29.39,17.86 32.13,20.8 43.64,28.32 46.05,32.31 44.88,29.39 20.63,31.6 20.48,36.58 23.52,38.63 27.1,38.73 34.39,38.43 40.85,38.43 44.96,38.33 37.29,38.13 30.69,38.46 56.85,53.9 41.51,61.32 37.29,61.32 40.74,59.77 21.57,60.96 26.47,55.02 25.15,54.97 27.79,54.99 29.44,61.7 35.31,61.67 37.72,59.49 43.56,59.54 39.17,61.8 50.09,73.3 49.96,68.91 50.09,64.49 50.68,60.25 52.78,72.29 52.78,66.45 55.73,69.57 51.11,76.07 48.34,71.32 10.49,69.7 10.47,67.01 12.3,63.04 13.39,75.41 22.53,76.3 16.59,76.48 26.37,75.34 28.3,75.34 30.2,75.31 31.58,75.29 33.73,75.29 26.34,70.64 28.17,71.35 29.09,71.35 30.2,71.3 31.17,71.35 32.13,71.35 33.86,71.35 34.88,71.32 28.63,70.61 29.7,70.61 30.81,70.61 31.78,70.61 32.77,70.59 33.68,70.59 33.1,71.32 34.62,70.64 28.04,69.95 29.14,70 30.31,70 31.35,70 32.39,70 33.45,69.98 34.47,69.98 27.05,71.32 26.01,71.35 27.56,70.71 27.05,70.03 25.83,69.93 25.96,67.84 27.21,67.79 28.32,67.77 29.77,67.77 31.07,67.79 32.46,67.82 33.73,67.82 34.7,67.79 38.46,71.02 38.71,69.65 39.02,68.43 43.59,76.5 39.98,76.61 38,76.68 37.44,75.34 32.64,75.29 34.88,75.31 8.61,74.75 15.78,75.46 19.94,76.53 11.92,72.72 7.85,70.71 8.38,67.97 8.28,65.56 13.06,68.78 12.55,65.3 8.87,58.57 12.58,59.26 11.81,55.78 9.35,55.19 11.86,52.32 14.58,53.14 14.58,50.6 10.8,59.08 8.99,52.6 4.85,83.24 23.98,43.03 27.03,43.18 30.15,43.33 34.17,43.28 37.06,43.28 41.35,43.13 42.37,44.4 33.66,44.81 31.12,45.09 28.53,45.14 21.52,40.84 26.85,45.01 24.67,44.6 10.72,36.12 10.87,33.66 10.29,30.2 8.66,34.49 8.18,31.11 9.88,44.17 12.53,37.44 12.47,30.99 9.25,25.65 9.63,22.83 9.96,21.29 7.88,22.3 7.83,26.39 7.9,23.85 10.16,26.59 11.2,16.99 9.22,18.06 13.59,17.09 10.75,10.77 9.5,14.15 9.48,7.29 4.65,0.99 5.67,2.82 5.03,4.83 7.37,10.57 13.31,3.94 15.83,4.22 20.93,5.23 24.64,4.52 27.64,7.44 18.9,4.34 23.45,11 37.09,12.73 38.1,16.84 40.36,19.99 49.25,20.09 51.77,13.11 55.98,13.74 60.61,0.94 59.31,2.82 61.29,4.8 54.84,36.2 56.04,43.61 56.04,48.69 46.03,48.34 47.22,45.52 44.61,47.35 46.31,50.19 44.58,49.25 54.74,57.71 54.44,51.69 58.32,39.9 54.84,31.42 52.48,23.67 44.43,16.99
  pour Top (isolate 0.305, rank 6): -0.95,85 -0.95,0 66.05,0 66.05,85
  pour Bottom (isolate 0.305, rank 6): 0.05,0 66.05,0 66.05,85 0.05,85
  pour Top (rank 6): 27.31,47.57 35.31,47.57 35.31,46.48 27.31,46.48
IM1
  Top 0.254: P5.39 23.78,52.02 R36.1 R35.2
IO0  (via drill 0.3)
  Top 0.254: U8.7 45.54,52.07 45.37,52.25 45.37,53.37 | 45.37,53.37 45.37,54.05 R42.1 | P2.4 40.74,25.35 41.13,24.97 v41.66,24.97 | v45.27,53.37 45.37,53.37 | U1.12 25.56,65.66 24.97,65.08 v22.03,65.08
  Bottom 0.254: v41.66,24.97 43.82,24.97 48.82,29.97 48.82,51.05 46.51,53.37 v45.27,53.37 33.73,53.37 v22.03,65.08
IO1  (via drill 0.3)
  Top 0.254: R67.1 42.53,70.66 v42.93,70.66 SD.2 | U1.13 26.36,65.95 v26.37,65.94 | D4.1 41.99,75.56 v42.93,75.56
  Bottom 0.254: v26.37,65.94 27.31,66.88 41.94,66.88 42.93,67.87 v42.93,70.66 v42.93,75.56
IO2/SDA  (via drill 0.3)
  Top 0.254: 47.66,53.07 U8.9 47.31,53.07 | 47.66,53.07 R44.1 | P2.2 39.74,24.53 v39.98,24.28 | CN1.2 20.24,66.39 20.92,67.07 | 20.92,67.07 22.33,68.48 R9.2 22.63,72.42 U1.5 | v20.93,67.09 20.92,67.07 | 47.66,53.07 47.66,53.16 v47.63,53.19
  Bottom 0.254: v39.98,24.28 44,24.28 49.38,29.67 49.38,51.44 v47.63,53.19 46.82,54 34.02,54 v20.93,67.09
IO3/SCL  (via drill 0.3)
  Top 0.254: 46.54,53.57 U8.10 46.55,53.57 46.55,53.6 v47.45,54.51 47.48,54.51 R43.1 | P2.3 40.24,25.04 41.18,24.11 v41.18,23.65 | U1.6 23.64,71.62 22.89,70.87 22.89,67.92 22.03,67.06 | 22.03,67.06 19.36,64.39 CN1.1 | v21.95,67 22.01,67.06 22.03,67.06
  Bottom 0.254: v41.18,23.65 44.25,23.65 49.94,29.34 49.94,52.02 v47.45,54.51 34.44,54.51 v21.95,67
IO4/NSS0
  Top 0.254: P5.9 38.78,50.3 37.49,51.59 37.49,56.49 29.7,64.29 29.7,65.38 30.36,66.04 U1.18
IO5/SCLK  (via drill 0.3)
  Top 0.254: v31.17,60.91 36.38,55.7 36.38,50.9 37.78,49.49 P5.11 | U1.19 31.17,66.71 v31.17,65.86 | SD.5 42.37,67.36 R69.1 42.37,67.36 v43.54,67.36 | D4.5 41.21,74.22 41.35,74.37 v43.54,74.37
  Bottom 0.254: v31.17,60.91 v31.17,65.86 31.68,66.37 42.95,66.37 43.54,66.95 v43.54,67.36 v43.54,74.37
IO6/MOSI  (via drill 0.3)
  Top 0.254: P5.13 36.78,49.66 35.77,50.67 35.77,55.42 v31.93,59.26 | 31.93,66.69 U1.20 v31.96,65.66 | SD.3 v44.15,69.56 42.23,69.56 R68.1 | 40.46,75.63 D4.3 40.46,75.12 40.59,74.98 v44.15,74.98 | v31.96,65.66
  Bottom 0.254: v31.93,59.26 v31.96,65.66 32.16,65.86 43.31,65.86 44.15,66.7 v44.15,69.56 v44.15,74.98
IO7/MISO  (via drill 0.3)  (1 unrouted)
  Top 0.254: v32.82,65.2 32.82,66.66 U1.21 | R2.1 34.48,53.42 D6.- 34.83,55.42 v32.82,57.43 | SD.7 v43.16,65.16 42.21,65.16 R70.1 | D4.6 44.79,73.8
  Bottom 0.254: v32.82,57.43 32.82,64.8 | 32.82,64.8 v32.82,65.2 33.23,65.2 | 33.23,65.2 43.12,65.2 | 43.12,65.2 v43.16,65.16 | v44.81,73.79 44.81,66.4 43.62,65.2 43.12,65.2 | 33.23,65.2 32.82,64.8
IO8  (via drill 0.3)
  Top 0.254: R12.1 23.35,57.86 R41.2 23.37,61.19 v26.65,64.47 | U1.22 | U1.22 33.56,64.9 33.12,64.47 v30.53,64.47
  Bottom 0.254: v26.65,64.47 v30.53,64.47
IO9  (via drill 0.3)
  Top 0.254: BOOT.1 12.34,9.22 R19.1 | Q3.3 12.44,9.28 R19.1 | R19.1 v12.42,8.03 | v34.34,63.25 v34.36,63.26 U1.23
  Bottom 0.254: v12.42,8.03 25.45,8.03 39.35,21.92 45.14,21.92 52.02,28.8 52.02,53.85 42.62,63.25 v34.34,63.25
IO10/LCD_RS
  Top 0.254: P5.10 38.28,49.86 36.96,51.18 36.96,56.24 36.71,56.49 36.35,56.85 R34.2 28.69,66.65 U1.16
N$1
  Top 0.254: IC1.16 C18.1
N$2
  Top 0.254: R26.1 16.6,11.93 15.47,13.06 14.44,13.06 Q4.1
N$3
  Top 0.254: Q3.1 17.34,5.83 18.37,6.86 R25.1
N$4
  Top 0.254: R2.2 34.31,51.9 D6.+ 34.83,50.75 36.27,49.3 P5.14
N$7
  Top 0.406: R16.2 31.02,11.56 D3.C
N$10
  Top 0.254: USB-TTL.A5 15.49,25.25 R46.1
N$11
  Top 0.254: USB-TTL.B5 15.01,22.25 R48.1
N$12
  Top 0.254: IC1.7 21.17,18.76 R27.2 21.09,17.14 R28.2
  pour Top: 20.48,16.59 20.48,21.67 21.11,22.3 21.19,22.3 21.19,19.56 21.54,19.2 21.54,16.56 20.5,16.56
N$13  (via drill 0.3)
  Top 0.254: R3.1 v19.41,43.23 | v37.34,69.22 U1.27
  Bottom 0.254: v19.41,43.23 19.41,68.48 20.15,69.22 v37.34,69.22
N$14
  Top 0.254: USB-NATIVE.A5 14.85,45.25 R5.2
N$15
  Top 0.254: USB-NATIVE.B5 15.41,42.25 R4.2
N$16  (via drill 0.3)
  Top 0.254: R17.1 v19.94,44.83 | v37.34,68.43 U1.26
  Bottom 0.254: v19.94,44.83 19.94,67.92 20.6,68.58 37.19,68.58 v37.34,68.43
N$18
  Top 0.254: IC1.21 22.67,27.24 21.24,28.68 18.6,28.68 R29.2
N$19
  Top 0.254: IC1.20 23.17,27.56 21.36,29.36 19.63,29.36 R30.2
N$20
  Top 0.254: P5.34 26.28,48.55 27.94,50.22 29.52,50.22 R37.1
N$21
  Top 0.254: P5.35 25.78,48.89 27.82,50.93 28.49,50.93 R38.1
N$22
  Top 0.254: P5.36 25.28,49.33 R39.1
N$23
  Top 0.254: R40.1 24.96,57.82 R41.1 26.82,57.89 Q5.1
N$24
  Top 0.254: R39.2 29.14,53.75 | 29.14,53.75 R38.2 R37.2 | Q5.3 29.03,53.86 29.14,53.75
N$25
  Top 0.254: U8.8 48.49,52.57 R52.1 R49.2
N$26  (via drill 0.3)
  Top 0.254: R6.1 R7.1 v21.9,48.03 | P5.33 26.78,47.96 v26.93,48.11
  Bottom 0.254: v21.9,48.03 26.85,48.03 v26.93,48.11
N$47
  Top 0.254: SD.1 43.84,71.76 43.03,72.57 R72.1
N$48
  Top 0.254: R71.1 42.26,63.59 42.62,63.96 44.99,63.96 SD.8
RESET  (via drill 0.3)  (1 unrouted)
  Top 0.254: 12.39,12.17 Q4.3 v12.39,12.15 v12.4,12.14 12.4,11.16 12.39,11.16 R10.2 | RST.2 12.38,12.15 | C1.2 38.73,55.54 R47.1 v38.73,52.73 | P5.15 35.78,48.85 v34.7,49.94 | P2.5 41.24,25.9 41.41,25.73 v41.81,25.73 | U1.8 23.87,70.02 23.45,69.6 23.45,67.46 v21.03,65.05
  Bottom 0.254: v12.4,12.14 13.31,12.14 15.73,9.73 24.44,9.73 40.44,25.73 v41.81,25.73 43.56,25.73 48.31,30.48 48.31,50.8 46.38,52.73 v38.73,52.73 35.08,52.73 | v21.03,65.05 33.35,52.73 34.32,52.73 | 34.32,52.73 34.7,52.73 | 34.7,52.73 35.08,52.73 | 34.7,52.35 34.7,52.73 | 34.32,52.73 34.7,52.35 | 34.7,52.35 35.08,52.73 | 34.7,52.35 v34.7,49.94
RTS  (via drill 0.3)
  Top 0.254: Q4.2 18.37,11 v18.37,10.37 v18.37,10.36 R25.2 | v24.54,26.04 23.69,26.04 IC1.19
  Bottom 0.254: v18.37,10.36 20.37,10.36 24.54,14.53 v24.54,26.04
RXD0  (via drill 0.3)
  Top 0.254: R29.1 18.27,32.03 v18.27,32.77 | v37.27,71.63 U1.30
  Bottom 0.254: v18.27,32.77 18.8,33.3 18.8,70.08 20.91,72.19 36.71,72.19 v37.27,71.63
TXD0  (via drill 0.3)
  Top 0.254: R30.1 19.19,32.8 v18.22,33.78 | v37.65,72.42 U1.31
  Bottom 0.254: v18.22,33.78 18.22,70.36 20.55,72.69 37.37,72.69 v37.65,72.42
USB_DN
  Top 0.254: R17.2 15.92,44.75 USB-NATIVE.B7 12.19,44.75 11.89,44.45 11.89,44.02 12.17,43.74 13.14,43.74 USB-NATIVE.A7
USB_DP
  Top 0.254: USB-NATIVE.B6 14.28,43.25 | 14.28,43.25 15.99,43.25 R3.2 | USB-NATIVE.A6 14.05,44.25 14.28,44.02 14.28,43.25
VBUS  (via drill 0.3)
  Top 0.254: IC1.8 21.67,20.62 v22.79,19.51 23.14,19.86 D5.A
  Top 0.61: USB-TTL.VBUS2 14.67,21.55 14.99,21.23 C15.1 | USB-TTL.VBUS1 14.64,26.45 14.94,26.75 15.5,26.75 C25.1
  Top 0.813: C25.1 15.65,26.87 v15.65,27.86 | v22.79,19.51 R27.1 | C15.1 15.55,20.63 v15.83,20.34
  Bottom 0.813: v15.65,27.86 15.65,20.52 v15.83,20.34 16.21,19.96 16.61,19.56 22.74,19.56 v22.79,19.51
  pour Top: 21.54,22.33 21.54,20.22 22.2,19.56 22.2,18.14 26.95,18.14 26.95,20.75 22.2,20.75 21.8,21.16 21.8,22.33
XL
  Top 0.254: P5.1 42.78,50.58 43.18,50.98 43.18,51.82 42.93,52.07 U8.4
XR
  Top 0.254: U8.2 41.44,53.07 41.25,52.88 41.25,51.13 41.78,50.6 P5.3
YD  (via drill 0.3)
  Top 0.254: P5.4 41.28,50.19 v41.1,50.37 | U8.3 43.19,52.57 43.64,52.12 v43.64,50.37
  Bottom 0.254: v43.64,50.37 v41.1,50.37
YU
  Top 0.254: P5.2 42.28,51.49 U8.5

### Text on the board
tPlace: GND | +3V3 | SDA | SCL | ESP32-C3 TFT Touch | v1.1 | (3.5'' ili9488) | www.makerfabs.com